# EAGLE design koszulka_led (EAGLE 6.5.0)
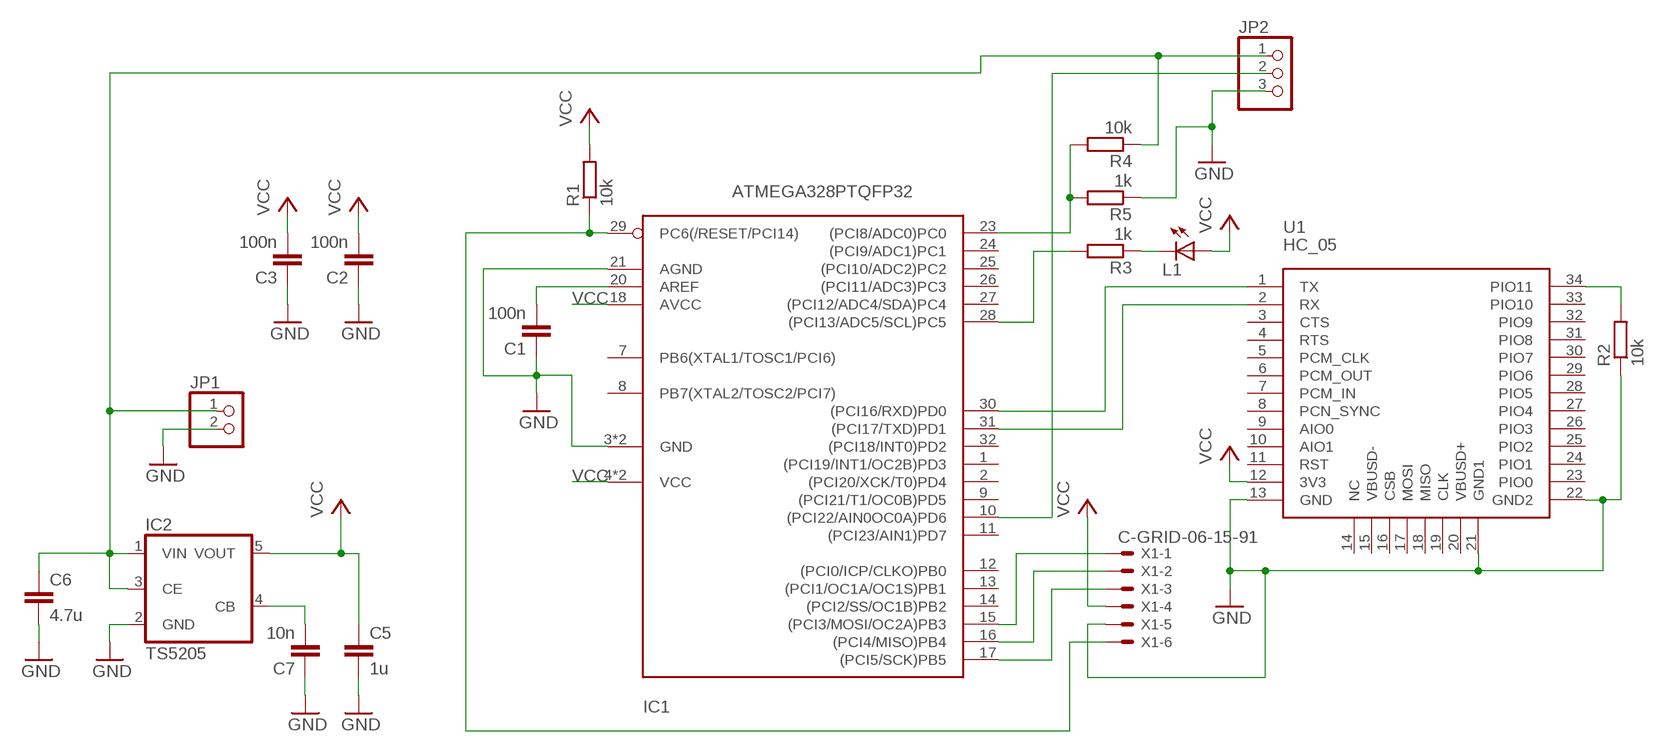
[diagram p0: schematic, sheet 1]

## Parts
C1  100n  C-EUC0402  [C0402]
C2  100n  C-EUC0402  [C0402]
C3  100n  C-EUC0402  [C0402]
C5  1u  C-EUC0805  [C0805]
C6  4.7u  C-EUC0805  [C0805]
C7  10n  C-EUC0402  [C0402]
IC1  ATMEGA328PTQFP32  [TQFP32-08]
IC2  TS5205  [SOT25]
JP1  PINHD-1X2  [1X02]
JP2  PINHD-1X3  [1X03]
L1  LEDCHIP-LED0603  [CHIP-LED0603]
R1  10k  R-EU_R0603  [R0603]
R2  10k  R-EU_R0603  [R0603]
R3  1k  R-EU_R0603  [R0603]
R4  10k  R-EU_R0603  [R0603]
R5  1k  R-EU_R0603  [R0603]
U1  HC_05  [BLUETOOTH_SMD]
X1  C-GRID-06-15-91  [15-91-06]

## Nets
GND: C1.1 C2.1 C3.1 C5.2 C6.2 C7.1 IC1.3(GND) IC1.5(GND) IC1.21(AGND) IC2.2(GND) JP1.2 JP2.3 R2.1 R5.1 U1.13(GND) U1.21(GND1) U1.22(GND2) X1.5
N$1: IC1.29(PC6(/RESET/PCI14)) R1.1 X1.6
N$2: C1.2 IC1.20(AREF)
N$3: IC1.30((PCI16/RXD)PD0) U1.1(TX)
N$4: IC1.31((PCI17/TXD)PD1) U1.2(RX)
N$5: IC1.17((PCI5/SCK)PB5) X1.3
N$6: IC1.16((PCI4/MISO)PB4) X1.2
N$7: R2.2 U1.34(PIO11)
N$8: IC1.15((PCI3/MOSI/OC2A)PB3) X1.1
N$9 [VCC]: C6.1 IC2.1(VIN) IC2.3(CE) JP1.1 JP2.1 R4.1
N$10: IC1.10((PCI22/AIN0OC0A)PD6) JP2.2
N$12: C7.2 IC2.4(CB)
N$13: IC1.28((PCI13/ADC5/SCL)PC5) R3.2
N$14: L1.C R3.1
N$15: IC1.23((PCI8/ADC0)PC0) R4.2 R5.2
VCC [VCC]: C2.2 C3.2 C5.1 IC1.4(VCC) IC1.6(VCC) IC1.18(AVCC) IC2.5(VOUT) L1.A R1.2 U1.12(3V3) X1.4
Unconnected: IC1.1((PCI19/INT1/OC2B)PD3) IC1.2((PCI20/XCK/T0)PD4) IC1.7(PB6(XTAL1/TOSC1/PCI6)) IC1.8(PB7(XTAL2/TOSC2/PCI7)) IC1.9((PCI21/T1/OC0B)PD5) IC1.11((PCI23/AIN1)PD7) IC1.12((PCI0/ICP/CLKO)PB0) IC1.13((PCI1/OC1A/OC1S)PB1) IC1.14((PCI2/SS/OC1B)PB2) IC1.24((PCI9/ADC1)PC1) IC1.25((PCI10/ADC2)PC2) IC1.26((PCI11/ADC3)PC3) IC1.27((PCI12/ADC4/SDA)PC4) IC1.32((PCI18/INT0)PD2) U1.3(CTS) U1.4(RTS) U1.5(PCM_CLK) U1.6(PCM_OUT) U1.7(PCM_IN) U1.8(PCN_SYNC) U1.9(AIO0) U1.10(AIO1) U1.11(RST) U1.14(NC) U1.15(VBUSD-) U1.16(CSB) U1.17(MOSI) U1.18(MISO) U1.19(CLK) U1.20(VBUSD+) U1.23(PIO0) U1.24(PIO1) U1.25(PIO2) U1.26(PIO3) U1.27(PIO4) U1.28(PIO5) U1.29(PIO6) U1.30(PIO7) U1.31(PIO8) U1.32(PIO9) U1.33(PIO10)

## Library data of the parts
C1-C3 C5-C7 = rcl:C-EU: CAPACITOR, European symbol
IC1 = atmega328:ATMEGA328*P: MICROCONTROLLER 32 kBytes FLASH 2 kBytes SRAM 1 kBytes EEPROM USART 8-channel 10 bit ADC
IC2 = v-reg:TS5205: 150mA Low Noise LDO Voltage Regulator with Enable TSC [Taiwan Semiconductor Company, Ltd] Source: http://www.taiwansemi.com .. 5205_0409c.pdf
JP1 = pinhead:PINHD-1X2: PIN HEADER
JP2 = pinhead:PINHD-1X3: PIN HEADER
L1 = led:LED: LED OSRAM: - CHIPLED LG R971, LG N971, LY N971, LG Q971, LY Q971, LO R971, LY R971 LH N974, LH R974 LS Q976, LO Q976, LY Q976 LO Q996 - Hyper CHIPLED LW Q18S LB Q993, LB Q99A, LB R99A - SideLED LS A670, LO A670, LY A670, LG A670, LP A670 LB A673, LV A673, LT A673, LW A673 LH A674 LY A675 LS A676, LA A676, LO A676, LY A676, LW A676 LS A679, LY A679, LG A679 - Hyper Micro SIDELED® LS Y876, LA Y876, LO Y876, LY Y876 LT Y87S - SmartLED LW L88C, LW L88S LB L89C, LB L89S, LG L890 LS L89K, LO L89K, LY L89K LS L896, LA L896, LO L896, LY L896 - TOPLED LS T670, LO T670, LY T670, LG T670, LP T670 LSG T670, LSP T670, LSY T670, LOP T670, LYG T670 LG T671, LOG T671, LSG T671 LB T673, LV T673, LT T673, LW T673 LH T674 LS T676, LA T676, LO T676, LY T676, LB T676, LH T676, LSB T676, LW T676 LB T67C, LV T67C, LT T67C, LS T67K, LO T67K, LY T67K, LW E67C LS E67B, LA E67B, LO E67B, LY E67B, LB E67C, LV E67C, LT E67C LW T67C LS T679, LY T679, LG T679 LS T770, LO T770, LY T770, LG T770, LP T770 LB T773, LV T773, LT T773, LW T773 LH T774 LS E675, LA E675, LY E675, LS T675 LS T776, LA T776, LO T776, LY T776, LB T776 LHGB T686 LT T68C, LB T68C - Hyper Mini TOPLED® LB M676 - Mini TOPLED Santana® LG M470 LS M47K, LO M47K, LY M47K Source: http://www.osram.convergy.de LUXEON: - LUMILED® LXK2-PW12-R00, LXK2-PW12-S00, LXK2-PW14-U00, LXK2-PW14-V00 LXK2-PM12-R00, LXK2-PM12-S00, LXK2-PM14-U00 LXK2-PE12-Q00, LXK2-PE12-R00, LXK2-PE12-S00, LXK2-PE14-T00, LXK2-PE14-U00 LXK2-PB12-K00, LXK2-PB12-L00, LXK2-PB12-M00, LXK2-PB14-N00, LXK2-PB14-P00, LXK2-PB14-Q00 LXK2-PR12-L00, LXK2-PR12-M00, LXK2-PR14-Q00, LXK2-PR14-R00 LXK2-PD12-Q00, LXK2-PD12-R00, LXK2-PD12-S00 LXK2-PH12-R00, LXK2-PH12-S00 LXK2-PL12-P00, LXK2-PL12-Q00, LXK2-PL12-R00 Source: www.luxeon.com KINGBRIGHT: KA-3528ASYC Source: www.kingbright.com
R1-R5 = rcl:R-EU_: RESISTOR, European symbol
U1 = SerialPortBluetooth:HC_05
X1 = con-molex2:C-GRID-06: CONNECTOR wire to board 2.54 mm (0.100") pitch header; OC_FARNELL: unknown; OC_NEWARK: unknown

## Net classes
0 default: width 0.254 mm, drill 0.406 mm, clearance 0.203 mm
1 VCC: width 0.508 mm, drill 0.406 mm, clearance 0.203 mm

## Board
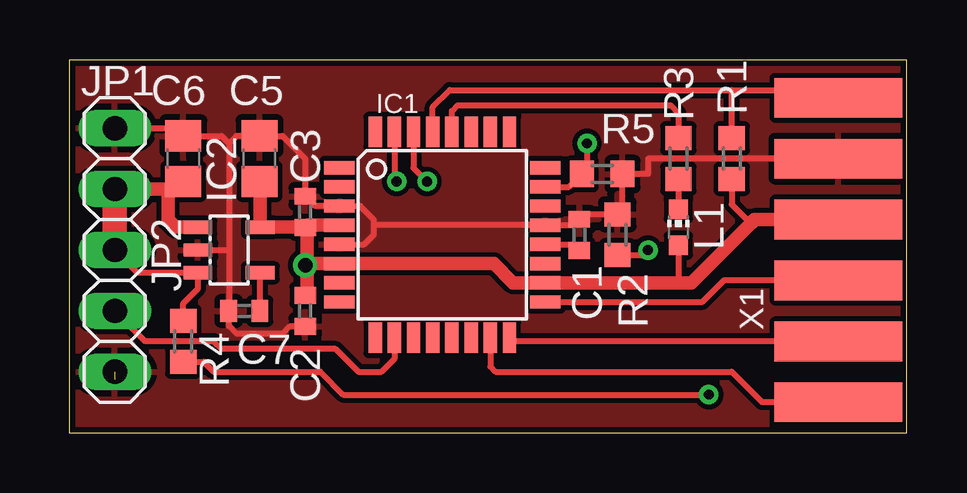
[diagram p1: board, top side]
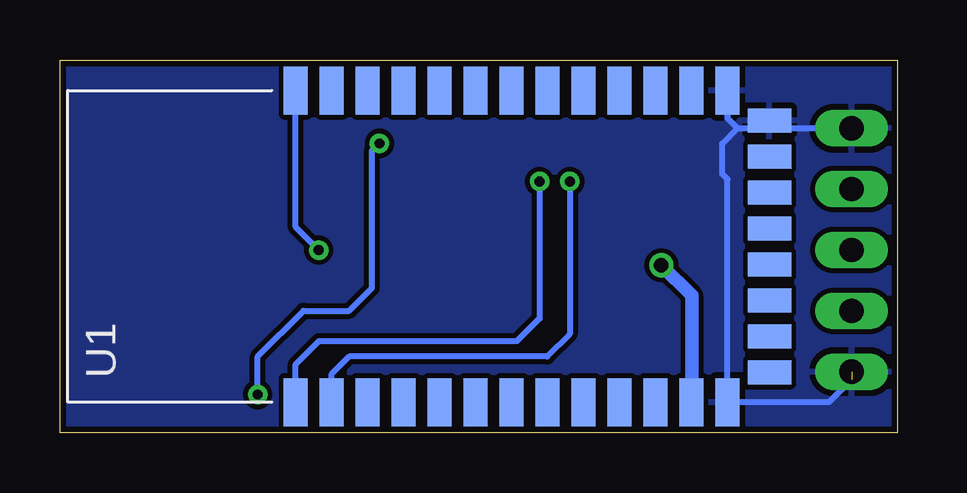
[diagram p2: board, bottom side, seen from below]

Size 34.91 x 15.55 mm. Coordinates in mm from the lower left corner, seen from the top.
Outline: 0,0 34.91,0 34.91,15.55 0,15.55 0,0
Copper layers (1*16): Top 0.035mm / dielectric 1.5mm / Bottom 0.035mm
Design rules "default *": minimum track width 8mil, minimum drill 16mil, track to track 8mil, track to pad 8mil, pad to pad 8mil, via to via 8mil, smd to smd 8mil, copper to edge 10mil, drill to drill 20mil, minimum pad ring 10mil, minimum via ring 8mil, stop-mask expansion 4mil, vias tented up to drill 0mil, thermal gap 10mil

### Footprints (pad centres in the part's own frame; a part is rotated, then mirrored left to right if it is on the bottom)
C0402 = smd 0.7 x 0.9: 1 -0.65,0; 2 0.65,0
C0805 = smd 1.3 x 1.5: 1 -0.95,0; 2 0.95,0
TQFP32-08 = smd 1.27 x 0.559: 1 -4.293,2.8; 2 -4.293,2; 3 -4.293,1.2; 4 -4.293,0.4; 5 -4.293,-0.4; 6 -4.293,-1.2; 7 -4.293,-2; 8 -4.293,-2.8; 17 4.293,-2.8; 18 4.293,-2; 19 4.293,-1.2; 20 4.293,-0.4; 21 4.293,0.4; 22 4.293,1.2; 23 4.293,2; 24 4.293,2.8 | smd 0.559 x 1.27: 9 -2.8,-4.293; 10 -2,-4.293; 11 -1.2,-4.293; 12 -0.4,-4.293; 13 0.4,-4.293; 14 1.2,-4.293; 15 2,-4.293; 16 2.8,-4.293; 25 2.8,4.293; 26 2,4.293; 27 1.2,4.293; 28 0.4,4.293; 29 -0.4,4.293; 30 -1.2,4.293; 31 -2,4.293; 32 -2.8,4.293
SOT25 = smd 0.55 x 1.2: 1 -0.95,-1.3; 2 0,-1.3; 3 0.95,-1.3; 4 0.95,1.3; 5 -0.95,1.3
1X02 = drill 1.016 long: 1 -1.27,0; 2 1.27,0
1X03 = drill 1.016 long: 1 -2.54,0; 2 0,0; 3 2.54,0
CHIP-LED0603 = smd 0.8 x 0.8: A 0,-0.75; C 0,0.75
R0603 = smd 1 x 1.1: 1 -0.85,0; 2 0.85,0
BLUETOOTH_SMD = smd 2 x 1: 1 0,0; 2 0,-1.5; 3 0,-3; 4 0,-4.5; 5 0,-6; 6 0,-7.5; 7 0,-9; 8 0,-10.5; 9 0,-12; 10 0,-13.5; 11 0,-15; 12 0,-16.5; 13 0,-18; 22 13,-18; 23 13,-16.5; 24 13,-15; 25 13,-13.5; 26 13,-12; 27 13,-10.5; 28 13,-9; 29 13,-7.5; 30 13,-6; 31 13,-4.5; 32 13,-3; 33 13,-1.5; 34 13,0 | smd 1 x 1.8: 14 1.25,-19.75; 15 2.75,-19.75; 16 4.25,-19.75; 17 5.75,-19.75; 18 7.25,-19.75; 19 8.75,-19.75; 20 10.25,-19.75; 21 11.75,-19.75
15-91-06 = smd 1.651 x 5.334: 1 -6.35,0.635; 2 -3.81,0.635; 3 -1.27,0.635; 4 1.27,0.635; 5 3.81,0.635; 6 6.35,0.635

### Placement (x,y rotation side)
C1  21.27,8.26 270 top
C2  9.84,5.08 90 top
C3  9.84,9.21 270 top
C5  7.94,11.43 90 top
C6  4.76,11.43 90 top
C7  7.3,5.08 0 top
IC1  15.56,8.26 0 top
IC2  6.67,7.62 270 top
JP1  1.91,11.43 90 top
JP2  1.91,5.08 270 top
L1  25.4,8.57 0 top
R1  27.62,11.43 270 top
R2  22.86,8.26 270 top
R3  25.4,11.43 90 top
R4  4.76,3.81 270 top
R5  22.23,10.79 180 top
U1  25.08,1.27 90 bottom
X1  32.7,7.62 90 top

### Tracks (layer width: path | path; a pad name or v marks a point on that pad's centre or on a via)
GND  (1 unrouted)
  Top 0.254: IC2.2 6.67,7.62 | 6.67,7.62 6.67,5.09 C7.1 6.67,5.07 6.67,4.45 6.99,4.13 8.89,4.13 9.19,4.43 C2.1 | 6.67,12.06 6.35,12.38 C6.2 4.44,12.7 JP1.2 | 6.67,12.06 6.67,7.62 | 6.67,12.06 6.98,12.38 C5.2 8.89,12.38 9.84,11.43 C3.1 10.24,9.46 IC1.3 12.13,9.46 12.7,8.89 12.7,8.57 | 12.7,8.57 12.7,8.26 12.3,7.86 IC1.5 | 12.7,8.57 12.78,8.65 IC1.21 21.02,8.65 C1.1 21.27,9.11 R2.1 23.07,9.11 R5.1 24.13,10.79 24.13,11.43 X1.5
  Bottom 0.254: U1.22 7.08,13.12 6.67,12.7 | 6.67,12.7 5.65,12.7 U1.21 5.01,12.7 JP1.2 | 1.91,2.22 2.86,1.27 U1.13 7.08,10.57 7.3,10.79 7.3,12.06 6.67,12.7
  pour Bottom: 0,15.56 34.92,15.56 34.92,0 0,0
  pour Top: 0,15.56 34.92,15.56 34.92,0 0,0
N$1
  Top 0.254: IC1.29 15.16,13.57 15.88,14.29 27.62,14.29 | R1.1 27.62,14.29 | 27.62,14.29 32.07,14.29 X1.6
N$2
  Top 0.254: IC1.20 21.02,7.86 C1.2
N$3  (via drill 0.41)
  Top 0.254: IC1.30 14.36,11.04 v14.92,10.48
  Bottom 0.254: v14.92,10.48 14.92,4.76 15.88,3.81 24.13,3.81 25.08,2.86 U1.1
N$4  (via drill 0.41)
  Top 0.254: IC1.31 13.56,10.57 v13.65,10.48
  Bottom 0.254: v13.65,10.48 13.65,4.13 14.61,3.17 22.86,3.17 23.58,2.45 U1.2
N$5
  Top 0.254: IC1.17 26.41,5.46 27.3,6.35 X1.3
N$6
  Top 0.254: X1.2 18.36,3.81 IC1.16
N$7  (via drill 0.41)
  Top 0.254: R2.2 23.91,7.41 v24.13,7.62
  Bottom 0.254: v24.13,7.62 25.08,8.57 U1.34
N$8
  Top 0.254: IC1.15 17.56,2.76 17.78,2.54 27.62,2.54 28.89,1.27 X1.1
N$9
  Top 0.254: R4.1 4.76,5.4 5.37,6 IC2.3 2.85,6.67 JP2.1
  Top 0.559: IC2.1 4.45,8.57 4.13,8.89 4.13,10.16 | 4.13,10.16 JP1.1 | 4.13,10.16 4.44,10.16 C6.1
  Top 1.016: JP2.1 JP1.1
N$10
  Top 0.254: IC1.10 13.56,3.08 13.02,2.54 12.06,2.54 11.11,3.49 6.35,3.49 6.03,3.81 3.17,3.81 JP2.2
N$12
  Top 0.254: C7.2 7.95,6.66 IC2.4
N$13
  Top 0.254: IC1.28 15.96,13.42 16.19,13.65 25.08,13.65 25.4,13.34 R3.2
N$14
  Top 0.254: R3.1 L1.C
N$15  (via drill 0.41)
  Top 0.254: IC1.23 20.84,10.26 R5.2 21.59,11.01 v21.59,12.06 | R4.2 5.61,2.96 6.03,2.54 10.48,2.54 11.43,1.59 v26.67,1.59
  Bottom 0.254: v26.67,1.59 26.67,3.17 24.77,5.08 22.86,5.08 21.91,6.03 21.91,11.75 v21.59,12.06
VCC  (via drill 0.6)
  Top 0.254: R1.2 27.62,9.53 28.42,8.73 | L1.A 25.4,6.25
  Top 0.559: C5.1 7.97,10.45 IC2.5 C3.2 | IC1.4 9.94,8.65 C3.2 | 9.91,7.05 IC1.6 17.71,7.05 18.51,6.25 IC1.18 25.4,6.25 25.94,6.25 28.42,8.73 28.57,8.89 X1.4 | 9.91,7.05 v9.84,6.99 | 9.91,7.05 9.91,5.8 C2.2 | 9.91,7.05 9.91,8.49 C3.2
  Bottom 0.559: v9.84,6.99 8.57,5.71 U1.12